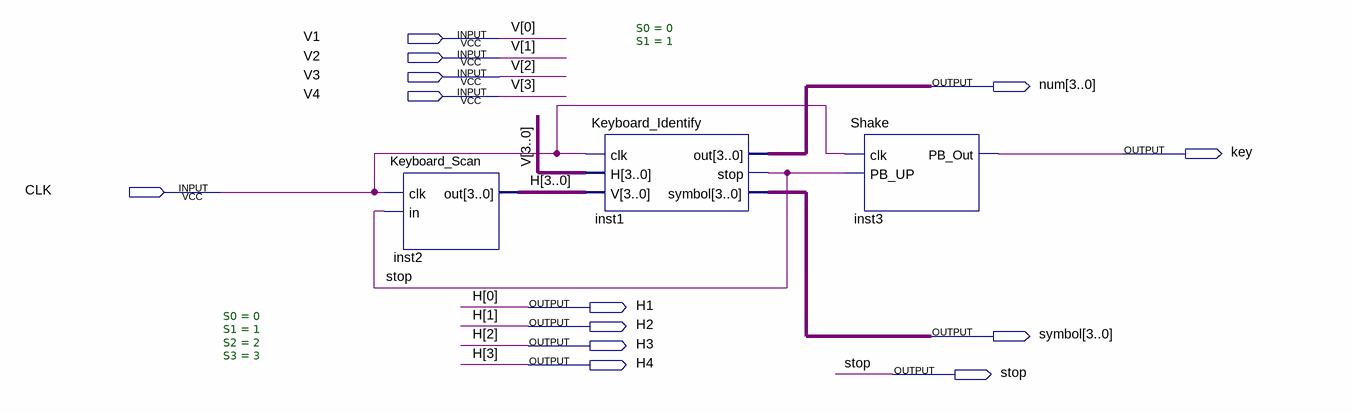
[diagram p0: schematic sheet]
// Quartus schematic key_input.bdf as structural Verilog: 3 symbols, 13 pins
module key_input (
  input  V1,
  input  V2,
  input  V3,
  input  V4,
  input  CLK,
  output [3:0] num,
  output key,
  output H1,
  output H2,
  output [3:0] symbol,
  output H3,
  output H4,
  output stop
);

  Keyboard_Scan #(.S0(0), .S1(1), .S2(2), .S3(3)) inst2 (.clk(CLK), .in(stop), .out({4{H1}}));
  Keyboard_Identify #(.S0(0), .S1(1)) inst1 (
    .clk(CLK), .H({V4, V3, V2, V1}), .V({4{H1}}), .out(num), .stop(stop), .symbol(symbol));
  Shake inst3 (.clk(CLK), .PB_UP(stop), .PB_Out(key));

  assign H2 = H1;
  assign H3 = H1;
  assign H4 = H1;

  // Other names for the same wires on the sheet: H (some bits) = {3{H1}}; V[3:0] = {V4, V3, V2, V1}
endmodule
